# EAGLE design midi11trigger (EAGLE 9.3.1)
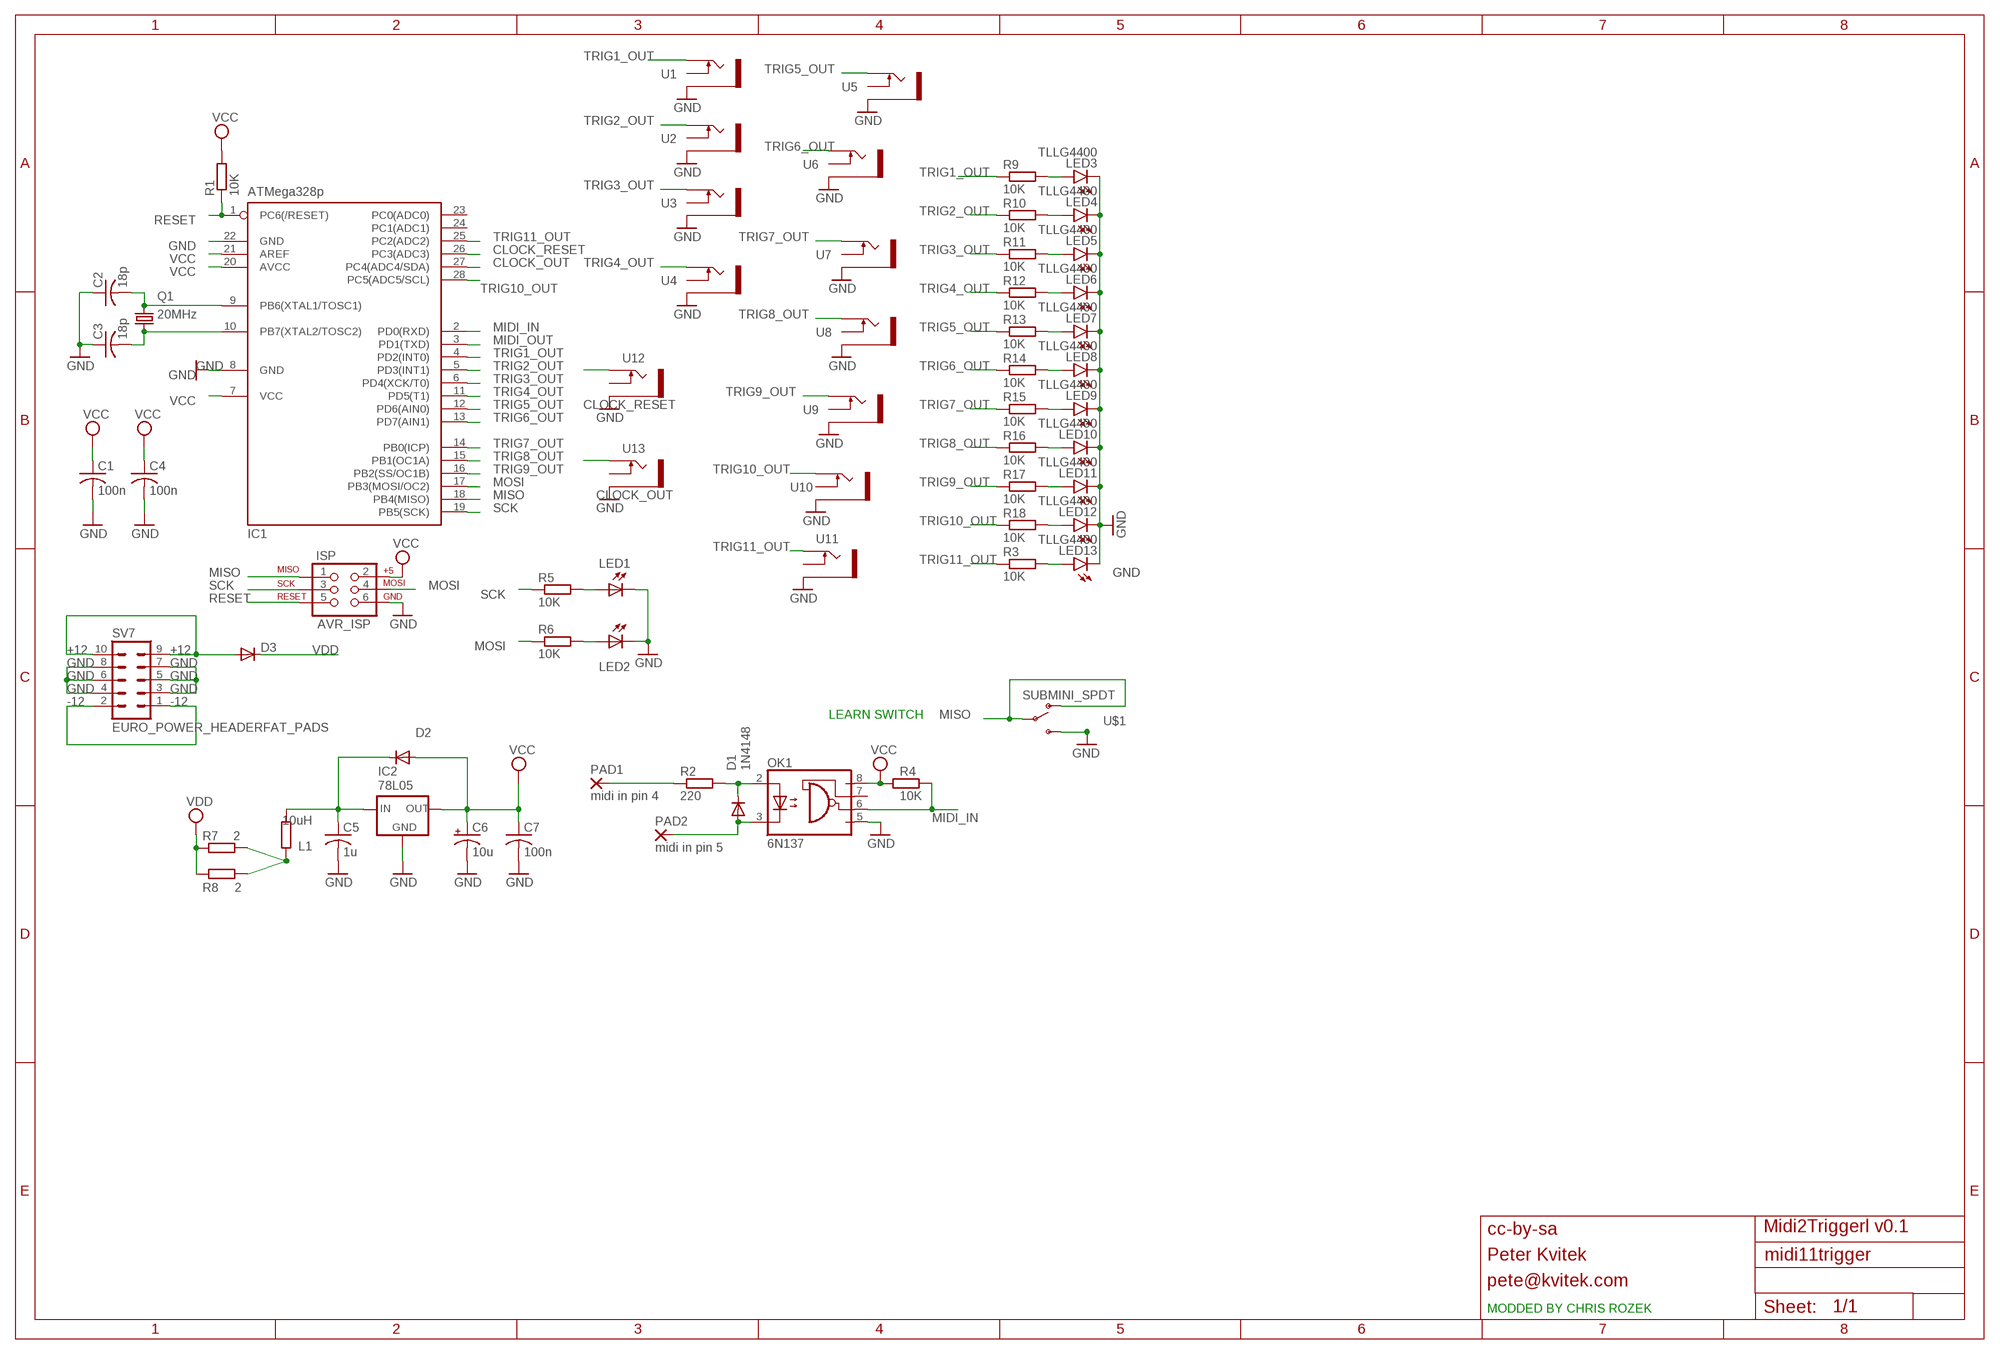
[diagram p0: schematic, sheet 1]

## Parts
C1  100n  C-US025-025X050  [C025-025X050]
C2  18p  C-US025-025X050  [C025-025X050]
C3  18p  C-US025-025X050  [C025-025X050]
C4  100n  C-US025-025X050  [C025-025X050]
C5  1u  C-US025-025X050  [C025-025X050]
C6  10u  CPOL-USE2.5-5  [E2,5-5]
C7  100n  C-US025-025X050  [C025-025X050]
D1  1N4148  SMALL_DIODEDO35-7  [DO35-7]
D2  SMALL_DIODEDO35-7  [DO35-7]
D3  SMALL_DIODEDO35-7  [DO35-7]
IC1  ATMega328p  MEGA8-P  [DIL28-3]
IC2  78L05  78LXX  [78LXX]
ISP  AVR_ISP  AVR_SPI_PRG_6PTH  [2X3]
L1  10uH  RESISTORVERTICAL  [VERTICAL_RESISTOR]
LED1  LED3MM  [LED3MM]
LED2  LED3MM  [LED3MM]
LED3  TLLG4400  [LED3MM]
LED4  TLLG4400  [LED3MM]
LED5  TLLG4400  [LED3MM]
LED6  TLLG4400  [LED3MM]
LED7  TLLG4400  [LED3MM]
LED8  TLLG4400  [LED3MM]
LED9  TLLG4400  [LED3MM]
LED10  TLLG4400  [LED3MM]
LED11  TLLG4400  [LED3MM]
LED12  TLLG4400  [LED3MM]
LED13  TLLG4400  [LED3MM]
OK1  6N137  [DIL08]
PAD1  midi in pin 4  2,54/1,1  [2,54/1,1]
PAD2  midi in pin 5  2,54/1,1  [2,54/1,1]
Q1  20MHz  CRYSTALHC49U-V  [HC49U-V]
R1  10K  RESISTORVERTICAL  [VERTICAL_RESISTOR]
R2  220  RESISTORVERTICAL  [VERTICAL_RESISTOR]
R3  10K  RESISTORVERTICAL  [VERTICAL_RESISTOR]
R4  10K  RESISTORVERTICAL  [VERTICAL_RESISTOR]
R5  10K  RESISTORVERTICAL  [VERTICAL_RESISTOR]
R6  10K  RESISTORVERTICAL  [VERTICAL_RESISTOR]
R7  2  RESISTORVERTICAL  [VERTICAL_RESISTOR]
R8  2  RESISTORVERTICAL  [VERTICAL_RESISTOR]
R9  10K  RESISTORVERTICAL  [VERTICAL_RESISTOR]
R10  10K  RESISTORVERTICAL  [VERTICAL_RESISTOR]
R11  10K  RESISTORVERTICAL  [VERTICAL_RESISTOR]
R12  10K  RESISTORVERTICAL  [VERTICAL_RESISTOR]
R13  10K  RESISTORVERTICAL  [VERTICAL_RESISTOR]
R14  10K  RESISTORVERTICAL  [VERTICAL_RESISTOR]
R15  10K  RESISTORVERTICAL  [VERTICAL_RESISTOR]
R16  10K  RESISTORVERTICAL  [VERTICAL_RESISTOR]
R17  10K  RESISTORVERTICAL  [VERTICAL_RESISTOR]
R18  10K  RESISTORVERTICAL  [VERTICAL_RESISTOR]
SV7  EURO_POWER_HEADERFAT_PADS  [EURO_PWR_HEADER_FAT]
U1  THONKICONNNEW  [WQP-PJ301M-12_JACK]
U2  THONKICONNNEW  [WQP-PJ301M-12_JACK]
U3  THONKICONNNEW  [WQP-PJ301M-12_JACK]
U4  THONKICONNNEW  [WQP-PJ301M-12_JACK]
U5  THONKICONNNEW  [WQP-PJ301M-12_JACK]
U6  THONKICONNNEW  [WQP-PJ301M-12_JACK]
U7  THONKICONNNEW  [WQP-PJ301M-12_JACK]
U8  THONKICONNNEW  [WQP-PJ301M-12_JACK]
U9  THONKICONNNEW  [WQP-PJ301M-12_JACK]
U10  THONKICONNNEW  [WQP-PJ301M-12_JACK]
U11  THONKICONNNEW  [WQP-PJ301M-12_JACK]
U12  THONKICONNNEW  [WQP-PJ301M-12_JACK]
U13  THONKICONNNEW  [WQP-PJ301M-12_JACK]
U$1  SUBMINI_SPDT  [SUBMINI_TOGGLE]

## Nets
+12: D3.A SV7.9 SV7.10
-12: SV7.1 SV7.2
CLOCK_OUT: IC1.27(PC4(ADC4/SDA)) U13.P$1_TIP(TIP)
CLOCK_RESET: IC1.26(PC3(ADC3)) U12.P$1_TIP(TIP)
GND: C1.2 C2.1 C3.1 C4.2 C5.2 C6.- C7.2 IC1.8(GND) IC1.22(GND) IC2.GND ISP.6 LED1.K(C) LED2.K(C) LED3.K(C) LED4.K(C) LED5.K(C) LED6.K(C) LED7.K(C) LED8.K(C) LED9.K(C) LED10.K(C) LED11.K(C) LED12.K(C) LED13.K(C) OK1.5(GND) SV7.3 SV7.4 SV7.5 SV7.6 SV7.7 SV7.8 U1.P$3_SLEEVE(SLEEVE) U2.P$3_SLEEVE(SLEEVE) U3.P$3_SLEEVE(SLEEVE) U4.P$3_SLEEVE(SLEEVE) U5.P$3_SLEEVE(SLEEVE) U6.P$3_SLEEVE(SLEEVE) U7.P$3_SLEEVE(SLEEVE) U8.P$3_SLEEVE(SLEEVE) U9.P$3_SLEEVE(SLEEVE) U10.P$3_SLEEVE(SLEEVE) U11.P$3_SLEEVE(SLEEVE) U12.P$3_SLEEVE(SLEEVE) U13.P$3_SLEEVE(SLEEVE) U$1.3(S)
MIDI_IN: IC1.2(PD0(RXD)) OK1.6(VO) R4.2
MIDI_OUT: IC1.3(PD1(TXD))
MISO: IC1.18(PB4(MISO)) ISP.1 U$1.1(O) U$1.COM(COMMON)
MOSI: IC1.17(PB3(MOSI/OC2)) ISP.4 R6.1
N$1: L1.1 R7.2 R8.2
N$2: D1.C OK1.2(A) R2.2
N$3: LED13.A R3.2
N$4: LED1.A R5.2
N$5: LED2.A R6.2
N$17: LED3.A R9.2
N$18: LED4.A R10.2
N$19: LED5.A R11.2
N$20: LED6.A R12.2
N$21: LED7.A R13.2
N$22: LED8.A R14.2
N$23: LED9.A R15.2
N$24: LED10.A R16.2
N$25: LED11.A R17.2
N$26: LED12.A R18.2
N$72: PAD1.1(P) R2.1
N$73: D1.A OK1.3(C) PAD2.1(P)
N$82: C3.2 IC1.10(PB7(XTAL2/TOSC2)) Q1.1
N$83: C2.2 IC1.9(PB6(XTAL1/TOSC1)) Q1.2
RESET: IC1.1(PC6(/RESET)) ISP.5 R1.1
SCK: IC1.19(PB5(SCK)) ISP.3 R5.1
TRIG1_OUT: IC1.4(PD2(INT0)) R9.1 U1.P$1_TIP(TIP)
TRIG2_OUT: IC1.5(PD3(INT1)) R10.1 U2.P$1_TIP(TIP)
TRIG3_OUT: IC1.6(PD4(XCK/T0)) R11.1 U3.P$1_TIP(TIP)
TRIG4_OUT: IC1.11(PD5(T1)) R12.1 U4.P$1_TIP(TIP)
TRIG5_OUT: IC1.12(PD6(AIN0)) R13.1 U5.P$1_TIP(TIP)
TRIG6_OUT: IC1.13(PD7(AIN1)) R14.1 U6.P$1_TIP(TIP)
TRIG7_OUT: IC1.14(PB0(ICP)) R15.1 U7.P$1_TIP(TIP)
TRIG8_OUT: IC1.15(PB1(OC1A)) R16.1 U8.P$1_TIP(TIP)
TRIG9_OUT: IC1.16(PB2(SS/OC1B)) R17.1 U9.P$1_TIP(TIP)
TRIG10_OUT: IC1.28(PC5(ADC5/SCL)) R18.1 U10.P$1_TIP(TIP)
TRIG11_OUT: IC1.25(PC2(ADC2)) R3.1 U11.P$1_TIP(TIP)
VCC: C1.1 C4.1 C6.+ C7.1 D2.A IC1.7(VCC) IC1.20(AVCC) IC1.21(AREF) IC2.OUT ISP.2 OK1.8(VCC) R1.2 R4.1
VDD: D3.C R7.1 R8.1
VREG_IN: C5.1 D2.C IC2.IN L1.2
Unconnected: IC1.23(PC0(ADC0)) IC1.24(PC1(ADC1)) OK1.7(VE) U1.P$2_SWITCH(SWITCH) U2.P$2_SWITCH(SWITCH) U3.P$2_SWITCH(SWITCH) U4.P$2_SWITCH(SWITCH) U5.P$2_SWITCH(SWITCH) U6.P$2_SWITCH(SWITCH) U7.P$2_SWITCH(SWITCH) U8.P$2_SWITCH(SWITCH) U9.P$2_SWITCH(SWITCH) U10.P$2_SWITCH(SWITCH) U11.P$2_SWITCH(SWITCH) U12.P$2_SWITCH(SWITCH) U13.P$2_SWITCH(SWITCH)

## Notes on the sheet
- LEARN SWITCH
- cc-by-sa | Midi2Triggerl v0.1
- Peter Kvitek
- pete@kvitek.com
- MODDED BY CHRIS ROZEK

## Library data of the parts
C1-C5 C7 = rcl:C-US: CAPACITOR, American symbol
C6 = rcl:CPOL-US: POLARIZED CAPACITOR, American symbol
D1-D3 = MusicThingModular:SMALL_DIODE: Small Signal Diode
IC1 = atmel:MEGA8-P: MICROCONTROLLER 8 Kbytes FLASH, 1 kbytes SRAM, 512 bytes EEPROM, USART, 4-channel 10 bit ADC, 2-channel 8 bit ADC Pin compatible with Atmega48, ATMega88, ATMega168 Source: avr.lbr; OC_FARNELL: unknown; OC_NEWARK: unknown
IC2 = v-reg:78LXX: VOLTAGE REGULATOR
ISP = SparkFun:AVR_SPI_PRG_6: AVR ISP 6 Pin This is the reduced ISP connector for AVR programming. Common on Arduino. This footprint will take up less PCB space and can be used with a 10-pin to 6-pin adapter such as SKU: BOB-08508
L1 R1-R18 = MusicThingModular:RESISTOR: Standard resistor, various versions
LED1 LED2 = led:LED: LED OSRAM: - CHIPLED LG R971, LG N971, LY N971, LG Q971, LY Q971, LO R971, LY R971 LH N974, LH R974 LS Q976, LO Q976, LY Q976 LO Q996 - Hyper CHIPLED LW Q18S LB Q993, LB Q99A, LB R99A - SideLED LS A670, LO A670, LY A670, LG A670, LP A670 LB A673, LV A673, LT A673, LW A673 LH A674 LY A675 LS A676, LA A676, LO A676, LY A676, LW A676 LS A679, LY A679, LG A679 - Hyper Micro SIDELED® LS Y876, LA Y876, LO Y876, LY Y876 LT Y87S - SmartLED LW L88C, LW L88S LB L89C, LB L89S, LG L890 LS L89K, LO L89K, LY L89K LS L896, LA L896, LO L896, LY L896 - TOPLED LS T670, LO T670, LY T670, LG T670, LP T670 LSG T670, LSP T670, LSY T670, LOP T670, LYG T670 LG T671, LOG T671, LSG T671 LB T673, LV T673, LT T673, LW T673 LH T674 LS T676, LA T676, LO T676, LY T676, LB T676, LH T676, LSB T676, LW T676 LB T67C, LV T67C, LT T67C, LS T67K, LO T67K, LY T67K, LW E67C LS E67B, LA E67B, LO E67B, LY E67B, LB E67C, LV E67C, LT E67C LW T67C LS T679, LY T679, LG T679 LS T770, LO T770, LY T770, LG T770, LP T770 LB T773, LV T773, LT T773, LW T773 LH T774 LS E675, LA E675, LY E675, LS T675 LS T776, LA T776, LO T776, LY T776, LB T776 LHGB T686 LT T68C, LB T68C - Hyper Mini TOPLED® LB M676 - Mini TOPLED Santana® LG M470 LS M47K, LO M47K, LY M47K Source: http://www.osram.convergy.de LUXEON: - LUMILED® LXK2-PW12-R00, LXK2-PW12-S00, LXK2-PW14-U00, LXK2-PW14-V00 LXK2-PM12-R00, LXK2-PM12-S00, LXK2-PM14-U00 LXK2-PE12-Q00, LXK2-PE12-R00, LXK2-PE12-S00, LXK2-PE14-T00, LXK2-PE14-U00 LXK2-PB12-K00, LXK2-PB12-L00, LXK2-PB12-M00, LXK2-PB14-N00, LXK2-PB14-P00, LXK2-PB14-Q00 LXK2-PR12-L00, LXK2-PR12-M00, LXK2-PR14-Q00, LXK2-PR14-R00 LXK2-PD12-Q00, LXK2-PD12-R00, LXK2-PD12-S00 LXK2-PH12-R00, LXK2-PH12-S00 LXK2-PL12-P00, LXK2-PL12-Q00, LXK2-PL12-R00 Source: www.luxeon.com KINGBRIGHT: KA-3528ASYC Source: www.kingbright.com
LED3-LED13 = led:TLLG4400: Low Current (2mA) LED 3 mm Tinted Diffused Package color GREEN Source: Data sheet <http://www.farnell.com/datasheets/391098.pdf>; MF: VISHAY SEMICONDUCTOR; OC_FARNELL: 1612435
OK1 = kvitekp:6N137: MOTOROLA OPTO COUPLER; MPN: 6N137; OC_FARNELL: 1328376; OC_NEWARK: 52M1895
PAD1 PAD2 = wirepad:2,54/1,1: THROUGH-HOLE PAD
Q1 = crystal:CRYSTAL: CRYSTAL; OC_FARNELL: 1666969; OC_NEWARK: unknown
SV7 = MusicThingModular:EURO_POWER_HEADER: Power Header 10 pin power header for Eurorack Power Supplies Variants with fatter pads for easier soldering, and the LOCK variant which has 5mil offset pins to hold the component in place before soldering
U1-U13 = MusicThingModular:THONKICONN: 3.5mm socket for Eurorack modular synths
U$1 = MusicThingModular:SUBMINI_SPDT

## Net classes
0 default: width 0.635 mm, drill 0.254 mm, clearance 0.254 mm
1 bigger: width 1.27 mm, drill 0.508 mm, clearance 0.635 mm

## Board
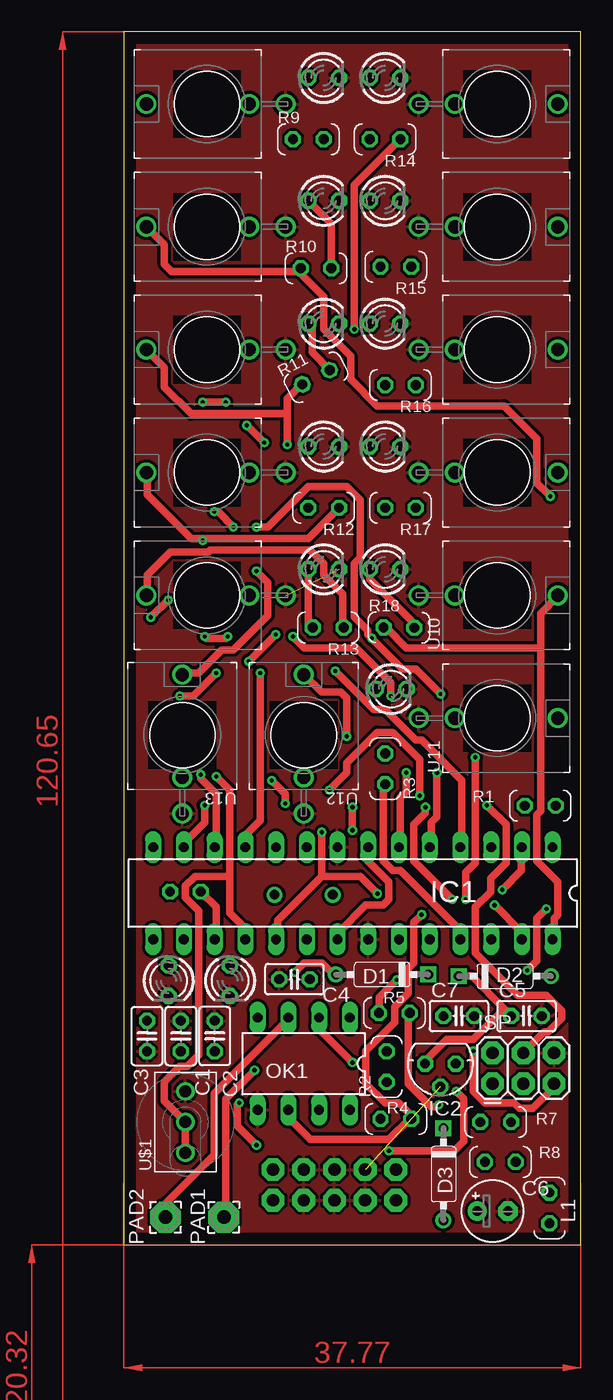
[diagram p1: board, top side]
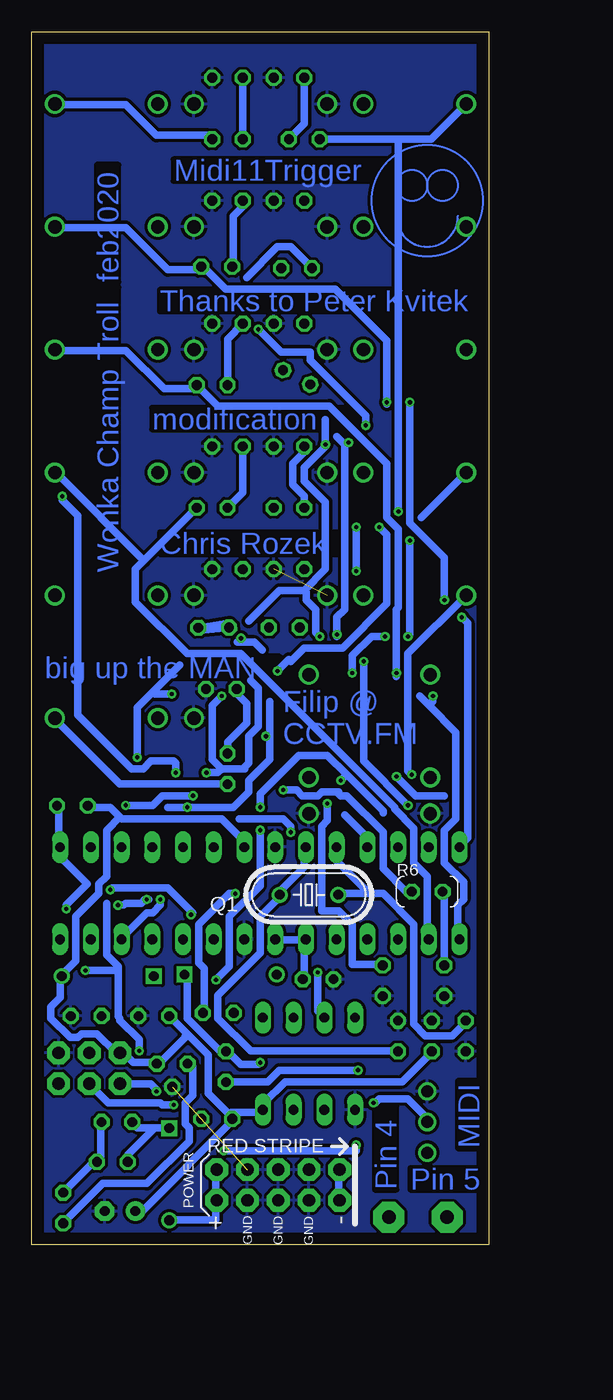
[diagram p2: board, bottom side, seen from below]

Size 37.77 x 100.32 mm. Coordinates in mm from the lower left corner, seen from the top.
Outline: 0,0 37.77,0 37.77,100.32 0,100.32 0,0
Copper layers (1*16): Top 0.035mm / dielectric 1.5mm / Bottom 0.035mm
Design rules "default": minimum track width 6mil, minimum drill 0.35mm, track to track 6mil, track to pad 6mil, pad to pad 6mil, via to via 6mil, smd to smd 6mil, copper to edge 40mil, drill to drill 6mil, minimum pad ring 10mil, minimum via ring 8mil, stop-mask expansion 4mil, vias tented up to drill 0mil, thermal gap 10mil

### Footprints (pad centres in the part's own frame; a part is rotated, then mirrored left to right if it is on the bottom)
C025-025X050 = drill 0.813 octagon: 1 -1.27,0; 2 1.27,0
E2,5-5 = drill 0.813 pad 1.6: + -1.27,0 | drill 0.813 pad 1.6 octagon: - 1.27,0
DO35-7 = drill 0.813: A 3.81,0 | drill 0.813 square: C -3.81,0
DIL28-3 = drill 0.813 long: 1 -16.51,-3.81; 2 -13.97,-3.81; 3 -11.43,-3.81; 4 -8.89,-3.81; 5 -6.35,-3.81; 6 -3.81,-3.81; 7 -1.27,-3.81; 8 1.27,-3.81; 9 3.81,-3.81; 10 6.35,-3.81; 11 8.89,-3.81; 12 11.43,-3.81; 13 13.97,-3.81; 14 16.51,-3.81; 15 16.51,3.81; 16 13.97,3.81; 17 11.43,3.81; 18 8.89,3.81; 19 6.35,3.81; 20 3.81,3.81; 21 1.27,3.81; 22 -1.27,3.81; 23 -3.81,3.81; 24 -6.35,3.81; 25 -8.89,3.81; 26 -11.43,3.81; 27 -13.97,3.81; 28 -16.51,3.81
78LXX = drill 0.813 octagon: GND 0,1.905; IN 1.27,0; OUT -1.27,0
2X3 = drill 1.016 pad 1.88 octagon: 1 0,0; 2 0,2.54; 3 2.54,0; 4 2.54,2.54; 5 5.08,0; 6 5.08,2.54
VERTICAL_RESISTOR = drill 0.813 octagon: 1 -1.27,0; 2 1.27,0
LED3MM = drill 0.813 octagon: A -1.27,0; K 1.27,0
DIL08 = drill 0.813 long: 1 -3.81,-3.81; 2 -1.27,-3.81; 3 1.27,-3.81; 4 3.81,-3.81; 5 3.81,3.81; 6 1.27,3.81; 7 -1.27,3.81; 8 -3.81,3.81
2,54/1,1 = drill 1.118 pad 2.54 octagon: 1 0,0
HC49U-V = drill 0.813: 1 -2.413,0; 2 2.413,0
EURO_PWR_HEADER_FAT = drill 1.016 pad 1.88 octagon: 1 -5.08,-1.27; 2 -5.08,1.27; 3 -2.54,-1.27; 4 -2.54,1.27; 5 0,-1.27; 6 0,1.27; 7 2.54,-1.27; 8 2.54,1.27; 9 5.08,-1.27; 10 5.08,1.27
WQP-PJ301M-12_JACK = drill 1.1: P$1_TIP 0,5; P$2_SWITCH 0,-3.5; P$3_SLEEVE 0,-6.5
SUBMINI_TOGGLE = drill 1 pad 1.422: 1 -2.54,0; 3 2.54,0; COM 0,0

### Placement (x,y rotation side)
C1  4.7,17.27 90 top
C2  7.49,17.27 270 top
C3  1.91,17.27 90 top
C4  14.1,21.97 180 top
C5  33.27,18.92 0 top
C6  30.48,2.79 0 top
C7  27.69,18.92 0 top
D1  21.34,22.35 180 top
D2  31.5,22.23 0 top
D3  26.42,5.84 270 top
IC1  18.92,29.08 180 top
IC2  26.16,14.99 180 top
ISP  30.48,13.34 0 top
L1  35.18,3.05 270 top
LED1  8.76,21.84 270 top
LED2  3.68,21.84 270 top
LED3  16.51,96.52 0 top
LED4  16.51,86.36 0 top
LED5  16.51,76.2 0 top
LED6  16.51,66.04 0 top
LED7  16.51,55.88 0 top
LED8  21.59,96.52 0 top
LED9  21.59,86.36 0 top
LED10  21.59,76.2 0 top
LED11  21.59,66.04 0 top
LED12  21.59,55.88 0 top
LED13  22.1,45.97 0 top
OK1  14.86,14.99 180 top
PAD1  8.26,2.29 0 top
PAD2  3.43,2.29 0 top
Q1  14.86,28.96 180 bottom
R1  34.42,36.32 180 top
R2  21.72,14.73 90 top
R3  21.59,39.37 90 top
R4  22.48,10.41 0 top
R5  22.35,19.18 180 top
R6  5.08,29.21 0 bottom
R7  30.73,10.16 0 top
R8  31.11,6.86 0 top
R9  15.24,91.44 0 top
R10  15.88,80.77 0 top
R11  15.88,71.75 27.6 top
R12  16.51,60.96 180 top
R13  16.89,51.05 180 top
R14  21.59,91.44 180 top
R15  22.48,80.9 180 top
R16  22.86,71.12 180 top
R17  22.86,60.96 180 top
R18  22.73,51.05 359.2 top
SV7  17.4,4.95 180 bottom
U1  6.86,94.36 90 top
U2  6.86,84.2 90 top
U3  6.86,74.04 90 top
U4  6.86,63.88 90 top
U5  6.86,53.72 90 top
U6  30.86,94.36 270 top
U7  30.86,84.2 270 top
U8  30.86,74.04 270 top
U9  30.86,63.88 270 top
U10  30.86,53.72 270 top
U11  30.86,43.56 270 top
U12  14.86,42.16 0 top
U13  4.83,42.16 0 top
U$1  5.08,10.16 90 top

### Tracks (layer width: path | path; a pad name or v marks a point on that pad's centre or on a via)
+12
  Bottom 0.635: D3.A 26.35,2.06 22.54,2.06 22.54,3.65 SV7.10 22.54,3.97 22.54,6.19 SV7.9
-12
  Bottom 0.635: SV7.2 12.38,3.81 12.38,6.19 SV7.1
CLOCK_OUT  (via drill 0.35)
  Top 0.635: v30.64,28.1 32.86,25.88 32.86,25.4 IC1.27 | v26.19,45.56 24.13,47.62 23.02,47.62 v20.48,50.16 20.16,50.48 20.16,50.8 19.05,51.91 19.05,56.36 19.53,56.83 19.53,61.6 18.41,62.71 15.24,62.71 11.91,59.37 v10.95,59.37 | v10.95,55.72 11.91,54.77 11.91,52.07 9.05,49.21 8.1,49.21 6.19,47.31 4.92,47.31 U13.P$1_TIP | v28.26,28.58 28.26,30.8 29.05,31.59 v29.05,40.32
  Bottom 0.635: 28.1,28.58 v28.26,28.58 28.42,28.58 28.73,28.26 30,28.26 30.16,28.1 v30.64,28.1 | v29.05,40.32 29.05,44.45 27.78,45.72 | 25.56,47.94 27.78,45.72 | 20.48,49.85 19.37,49.85 18.73,49.21 | 20.48,49.85 20.8,49.85 | v26.19,45.56 27.62,45.56 27.78,45.72 | v20.48,50.16 20.48,49.85 | v10.95,59.37 v10.95,55.72
CLOCK_RESET  (via drill 0.35)
  Top 0.635: v27.15,28.58 23.97,31.75 23.97,34.77 24.92,35.72 v24.92,36.2 | v18.41,42.07 18.41,45.24 17.94,45.72 16.35,45.72 14.92,47.15 U12.P$1_TIP
  Bottom 0.635: 26.51,36.2 v24.92,36.2 21.11,36.2 19.84,37.46 19.84,38.42 18.1,40.16 18.1,42.07 | 18.1,44.93 18.1,42.07 | IC1.26 30.32,25.4 28.26,27.46 27.78,27.46 27.15,28.1 v27.15,28.58 | v18.41,42.07 18.1,42.07
GND  (2 unrouted)
  pour Top: -1.27,102.87 39.37,102.87 40.64,104.14 40.64,-3.81 0,-3.81 -1.27,-2.54
  pour Bottom: 0,100.33 38.1,100.33 38.1,0 0,0
MIDI_IN  (via drill 0.35)
  Top 0.635: v31.27,29.37 32.86,30.96 32.86,32.86 IC1.2 | OK1.6 13.65,11.11 13.65,10.48 15.4,8.73 21.91,8.73 23.65,10.48 R4.2 23.65,10.79 22.7,11.75 21.59,11.75 20,13.34 20,16.03 22.38,18.41 22.38,19.69 23.5,20.8 23.5,22.86 23.97,23.34 23.97,26.67 v24.61,27.3
  Bottom 0.635: v31.27,29.37 31.11,29.53 26.51,29.53 24.45,27.46 v24.61,27.3
MISO  (via drill 0.35)
  Top 0.635: U$1.1 U$1.COM 3.33,11.91 3.33,13.49 4.6,14.76 5.24,14.76 6.19,15.72 6.19,27.62 5.08,28.73 5.08,29.69 5.87,30.48 8.73,30.48 | v7.62,38.73 8.73,37.62 8.73,30.48 | 8.73,30.48 8.73,27.46 10,26.19 10,25.4 IC1.18 | v27.46,12.7 28.1,12.06 28.1,8.57 27.3,7.78 v21.91,7.78 | v10.95,8.25 9.37,9.84 9.37,11.59 v9.53,11.75
  Bottom 0.635: v7.62,38.73 6.03,37.15 3.65,37.15 | ISP.1 27.94,13.34 27.46,12.86 v27.46,12.7 | U$1.COM 5.08,10.48 6.67,12.06 9.05,12.06 9.37,11.75 v9.53,11.75 | v21.91,7.78 10.95,7.78 v10.95,8.25
MOSI  (via drill 0.35)
  Top 0.635: v24.45,37.15 24.45,40.16 22.23,42.39 20.95,42.39 18.41,39.85 18.41,39.05 v16.99,37.62 | R6.1 7.62,27.94 7.62,25.4 IC1.17 | ISP.4 34.77,17.62 35.08,17.62 36.2,18.73 36.2,19.37 34.92,20.64 32.54,20.64 29.05,24.13 29.05,27.94 30.32,29.21 30.32,30.32 31.59,31.59 31.59,34.77 v30,36.35
  Bottom 0.635: v30,36.35 27.78,36.35 26.99,37.15 v24.45,37.15 | R6.1 6.83,29.21 8.73,31.12 8.73,34.13 11.75,37.15 12.22,37.15 12.38,37.31 12.38,37.46 13.81,37.46 14.13,37.15 15.4,37.15 15.88,37.62 v16.99,37.62
N$1
  Bottom 0.635: R7.2 32.07,10.16 32.07,7.3 32.38,6.98 R8.2 32.54,6.98 35.08,4.45 L1.1
N$2  (via drill 0.35)
  Top 0.635: v18.89,15.08 16.19,17.78 16.19,18.73 OK1.2
  Bottom 0.635: D1.C 25.08,22.23 24.92,22.07 24.92,18.73 22.23,16.03 21.75,16.03 R2.2 21.43,15.88 20.48,14.92 19.05,14.92 v18.89,15.08
N$3
  Bottom 0.635: R3.2 21.59,41.59 20,43.18 20,44.77 20.8,45.56 20.8,45.88 LED13.A
N$4  (via drill 0.35)
  Top 0.635: v22.54,21.91 21.11,20.48 21.11,19.21 R5.2 | v13.34,36.51 13.34,37.31 v12.22,38.42 | v18.89,36.2 v18.89,34.29
  Bottom 0.635: 8.73,35.72 8.73,35.88 11.75,38.89 | 11.75,38.89 13.34,40.48 15.72,40.48 18.89,37.31 v18.89,36.2 | v18.89,34.29 18.89,29.69 21.43,27.15 21.43,23.02 v22.54,21.91 | v13.34,36.51 13.34,35.08 13.81,34.61 13.81,27.62 12.38,27.62 11.27,26.51 11.27,23.18 8.89,23.18 LED1.A | 11.75,38.89 v12.22,38.42
N$5
  Bottom 0.635: R6.2 3.65,29.05 3.65,23.18 LED2.A
N$6
  Bottom 0.152: 7.62,85.09 arc-180 2.54,85.09
N$17
  Bottom 0.635: R9.2 15.24,92.71 LED3.A
N$18
  Top 0.635: R10.2 17.14,84.46 LED4.A
N$19
  Top 0.635: LED5.A 15.56,75.88 15.56,73.82 16.99,72.39 R11.2
N$20
  Bottom 0.635: R12.2 15.24,61.91 16.19,62.87 16.19,64.61 15.24,65.56 LED6.A
N$21
  Top 0.635: LED7.A 15.24,51.43 R13.2
N$22
  Bottom 0.635: LED8.A R14.2
N$23
  Bottom 0.635: LED9.A 20.32,85.88 21.11,85.09 21.11,80.96 R15.2
N$24
  Bottom 0.635: R16.2 21.59,74.93 LED10.A
N$25
  Bottom 0.635: R17.2 20.32,62.23 LED11.A
N$26
  Top 0.635: LED12.A 20.32,55.09 23.97,51.43 23.97,51.12 R18.2
  Bottom 0.635: 21.43,51.43 R18.2
N$72  (via drill 0.35)
  Top 0.635: v10.79,14.45 8.41,12.06 8.41,2.54 8.26,2.38 PAD1.1
  Bottom 0.635: R2.1 21.59,13.49 18.26,13.49 17.3,14.45 v10.79,14.45
N$73  (via drill 0.35)
  Top 0.635: v14.13,22.54 14.92,23.34 16.35,23.34 17.46,22.23 D1.A | PAD2.1 3.49,2.38 3.49,3.49 7.46,7.46 7.46,12.54 13.65,18.73 OK1.3
  Bottom 0.635: v14.13,22.54 14.13,19.37 13.65,18.89 OK1.3
N$82
  Bottom 0.635: 10,29.05 12.38,29.05 Q1.1 | 10,29.05 8.73,29.05 6.19,26.51 6.19,18.26 5.24,17.3 3.02,17.3 1.91,18.41 C3.2 | IC1.10 12.54,32.86 12.54,31.75 10,29.21 10,29.05
N$83
  Bottom 0.635: C2.2 7.62,16.03 19.68,16.03 22.38,18.73 22.38,20.64 18.89,24.13 18.89,27.15 17.14,28.89 Q1.2 17.3,29.21 15.24,31.27 15.24,32.86 IC1.9
RESET  (via drill 0.35)
  Top 0.635: v34.92,27.78 34.13,26.99 34.13,23.49 v33.34,22.7 | ISP.5 35.56,13.02 33.81,11.27 32.7,11.27 32.23,11.75 29.84,11.75 28.89,12.7 v28.89,16.03
  Bottom 0.635: 30.64,22.7 30.64,23.02 31.59,23.97 31.59,28.26 | 30.64,22.7 30.64,18.89 30.48,18.73 30.48,18.57 28.89,16.99 v28.89,16.03 | R1.1 35.56,36.2 35.56,33.18 IC1.1 35.4,32.86 35.4,32.07 33.18,29.84 34.92,28.1 v34.92,27.78 | 30.64,22.7 v33.34,22.7
SCK  (via drill 0.35)
  Top 0.635: v26.04,11.59 25.88,11.43 25.4,11.43 23.5,13.34 23.5,19.05 R5.1 | 16.35,30.48 v16.35,34.13 | 16.35,30.48 12.7,26.83 12.7,25.4 IC1.19 | v20.95,29.05 19.53,30.48 16.35,30.48
  Bottom 0.635: 20.64,35.24 16.99,35.24 16.35,34.61 v16.35,34.13 | R5.1 23.5,19.21 23.5,22.86 23.97,23.34 23.97,26.51 21.43,29.05 v20.95,29.05 | ISP.3 31.43,11.75 27.15,11.75 26.99,11.59 v26.04,11.59
TRIG1_OUT  (via drill 0.35)
  Top 0.635: v17.46,47.47 20.64,44.29 21.59,44.29 24.13,41.75 24.61,41.75 27.94,38.42 27.94,33.02 IC1.4 | v9.05,59.37 7.78,60.64 v7.46,60.64
  Bottom 0.635: 7.46,91.44 4.76,91.44 1.91,94.3 U1.P$1_TIP | 7.46,91.44 R9.1 | 7.46,91.44 v7.46,60.64 | v17.46,47.47 16.51,48.42 16.35,48.26 15.24,49.37 12.06,49.37 8.41,53.02 8.41,58.74 v9.05,59.37
TRIG2_OUT  (via drill 0.35)
  Top 0.635: v25.88,39.05 25.88,35.4 25.4,34.92 25.4,33.02 IC1.5 | U2.P$1_TIP 1.91,84.14 3.33,82.71 3.33,81.12 3.97,80.49 14.45,80.49 14.61,80.65 R10.1 14.61,80.33 16.51,78.42 16.51,75.72 18.73,73.5 18.73,71.6 20.95,69.37 31.43,69.37 34.13,66.68 34.13,63.02 v35.24,61.91
  Bottom 0.635: 20,80.01 17.46,82.55 16.35,82.55 14.61,80.8 R10.1 | v25.88,39.05 25.88,39.85 26.04,40.01 27.94,40.01 28.57,39.37 29.53,39.37 33.97,43.82 33.97,60.32 35.24,61.6 v35.24,61.91
TRIG3_OUT  (via drill 0.35)
  Top 0.635: v23.34,39.05 23.34,37.46 22.86,36.99 22.86,33.02 IC1.6 | v13.49,66.2 13.49,68.74 | 13.49,68.74 13.49,70.01 14.61,71.12 R11.1 | 13.49,68.74 5.56,68.74 3.33,70.96 3.33,72.55 1.91,73.98 U3.P$1_TIP | v22.07,45.4 22.07,46.51 19.21,49.37 14.92,49.37 v13.97,50.32
  Bottom 0.635: 19.68,46.67 19.05,46.04 19.05,42.86 19.84,42.07 19.84,39.85 20.16,39.53 20.16,39.37 22.07,39.37 | 19.84,51.59 17.3,54.13 15.24,54.13 | 15.24,54.13 13.49,55.88 13.49,61.44 15.24,63.18 15.24,64.29 13.49,66.04 v13.49,66.2 13.49,68.26 | v23.34,39.05 22.38,39.05 22.07,39.37 | 22.07,39.37 22.86,40.16 22.86,44.61 v22.07,45.4 | v13.97,50.32 14.29,50.64 14.29,52.55 15.08,53.34 15.08,53.98 15.24,54.13
TRIG4_OUT  (via drill 0.35)
  Top 0.635: v11.27,47.31 11.27,35.08 10.16,33.97 10.16,33.02 IC1.11 | R12.1 15.24,58.42 6.51,58.42 | 6.51,58.42 5.56,58.42 1.91,62.07 1.91,63.82 U4.P$1_TIP | v8.57,50.32 8.41,50.16 6.83,50.16 v6.67,50.32 | v6.51,58.26 6.51,58.42
  Bottom 0.635: 11.91,35.56 10.16,33.81 10.16,33.02 IC1.11 | v11.27,47.31 11.27,48.74 9.68,50.32 v8.57,50.32 | 5.56,60.17 1.91,63.82 U4.P$1_TIP | v6.67,50.32 6.51,50.48 v6.51,58.26
TRIG5_OUT  (via drill 0.35)
  Top 0.635: v6.35,38.89 6.35,38.58 7.62,37.31 7.62,33.02 IC1.12 | R13.1 18.1,51.12 18.1,53.82 16.51,55.4 16.51,56.36 15.4,57.47 7.14,57.47 6.99,57.31 3.81,57.31 1.91,55.4 1.91,53.82 U5.P$1_TIP
  Bottom 0.635: v6.35,38.89 6.67,39.21 6.67,48.9 1.91,53.66 U5.P$1_TIP
TRIG6_OUT  (via drill 0.35)
  Top 0.635: v6.67,36.35 6.67,34.92 5.08,33.34 5.08,33.02 IC1.13 | v12.54,50.48 v10.32,48.26 | R14.1 19.05,87.63 v19.05,75.72 | v11.59,66.36 v10.16,67.79
  Bottom 0.635: v6.67,36.35 10.32,40.01 v10.32,48.26 | 12.54,50.32 v12.54,50.48 12.54,51.91 11.91,52.55 11.91,66.2 | 12.54,66.83 11.91,66.2 | R14.1 23.18,91.76 27.46,91.76 30,94.3 35.72,94.3 U6.P$1_TIP | v19.05,75.72 17.14,73.82 14.76,73.82 14.76,73.18 10.16,68.58 v10.16,67.79 | v11.59,66.36 11.75,66.36 11.91,66.2
TRIG7_OUT  (via drill 0.35)
  Top 0.635: v3.65,53.34 v2.22,51.91 | v8.41,69.69 v6.51,69.69
  Bottom 0.635: v3.65,53.34 3.65,56.83 6.51,59.69 v6.51,69.69 | 8.41,69.53 v8.41,69.69 8.41,74.77 12.7,79.06 21.75,79.06 23.65,80.96 R15.1 23.81,80.65 26.51,80.65 30,84.14 35.72,84.14 U7.P$1_TIP | v2.22,51.91 1.75,51.43 1.75,33.66 2.38,33.02 IC1.14
TRIG8_OUT  (via drill 0.35)
  Top 0.635: v4.6,45.4 5.71,45.4 v7.62,47.31
  Bottom 0.635: 5.71,45.4 4.92,44.61 | 4.92,44.61 2.7,42.39 2.7,35.24 3.65,34.29 3.65,31.59 2.06,30 2.06,28.58 2.54,28.1 2.54,25.4 IC1.15 | 7.62,46.99 v7.62,47.31 7.62,52.55 7.46,52.71 7.46,59.21 8.41,60.17 8.41,64.61 13.18,69.37 22.38,69.37 R16.1 24.13,70.8 26.83,70.8 30,73.98 35.72,73.98 U8.P$1_TIP | v4.6,45.4 4.6,44.93 4.92,44.61
TRIG9_OUT
  Bottom 0.635: R17.1 28.5,56.59 | 28.5,56.59 29.21,55.88 29.21,53.18 24.92,48.9 20.48,48.9 7.78,36.2 7.78,36.04 6.19,34.45 6.19,31.59 5.08,30.48 5.08,25.4 IC1.16 | 28.5,56.59 35.72,63.82 U9.P$1_TIP
TRIG10_OUT
  Top 0.635: 34.45,49.37 34.45,52.23 35.88,53.66 U10.P$1_TIP | 34.45,49.37 34.45,35.88 34.13,35.56 34.13,31.75 35.88,30 35.88,27.3 35.56,26.99 35.56,25.4 IC1.28 | 34.45,49.37 23.34,49.37 21.75,50.96 21.59,50.96 R18.1
  Bottom 0.635: 23.97,50.8 R18.1
TRIG11_OUT
  Top 0.635: R3.1 21.43,37.94 21.43,31.75 22.23,30.96 22.86,30.96 27.78,26.03 27.78,25.4 IC1.25
  Bottom 0.635: R3.1 30.48,38.1 35.88,43.5 U11.P$1_TIP
VCC
  Top 0.635: IC1.21 17.78,25.4 17.78,25.88 20,28.1 21.43,28.1 21.91,28.58 21.91,30 20.16,31.75 20.16,32.86 IC1.7
  Bottom 0.635: C4.1 15.24,22.07 15.24,25.24 IC1.20 15.56,25.24 17.62,25.24 IC1.21 | 30.48,35.4 30.32,35.24 22.07,35.24 20.32,33.5 20.32,33.02 IC1.7 | 30.48,35.4 31.27,36.2 33.02,36.2 R1.2 | C1.1 4.76,15.88 7.14,13.49 16.83,13.49 18.57,11.75 18.57,11.27 OK1.8 18.89,10.95 21.27,10.95 R4.1 | C6.+ 29.21,2.86 28.57,2.86 21.11,10.32 R4.1 | 24.92,17.46 23.18,15.72 23.18,12.54 21.27,10.64 R4.1 | 24.92,17.46 26.35,18.89 C7.1 | 30.48,35.4 31.59,34.29 31.59,30.48 32.23,29.84 32.23,29.05 34.13,27.15 34.13,23.49 35.24,22.38 D2.A 35.4,22.23 35.4,20.48 36.2,19.69 36.2,18.73 34.61,17.15 33.97,17.15 33.66,17.46 32.38,17.46 30.8,15.88 ISP.2 30.32,16.03 29.37,15.08 27.46,15.08 IC2.OUT 27.15,15.08 25.08,17.15 25.08,17.3 24.92,17.46
VDD
  Bottom 0.635: 27.78,9.68 29.05,9.68 29.53,10.16 R7.1 | 27.78,9.68 26.51,9.68 D3.C | R8.1 29.84,7.46 27.78,9.52 27.78,9.68
VREG_IN
  Top 0.635: 31.43,19.53 28.73,22.23 D2.C | 31.43,19.53 31.91,19.05 C5.1 | 31.43,19.53 28.89,16.99 26.67,16.99 24.77,15.08 IC2.IN
  Bottom 0.635: L1.2 35.08,1.91 31.91,5.08 28.26,5.08 24.77,8.57 24.77,9.68 25.08,10 25.08,11.75 24.45,12.38 24.45,14.76 24.77,15.08 IC2.IN
(copper drawn outside any net)
  shapes: Bottom circle x3, Top area x4

### Text on the board
Bottom: Midi11Trigger | feb2020 | Thanks to Peter Kvitek | modification | Chris Rozek | Wonka Champ Troll | big up the MAN | Filip @ / CCTV.FM | MIDI | Pin 5 | Pin 4